# EAGLE design led-er-v2.3c (EAGLE 7.5.0)
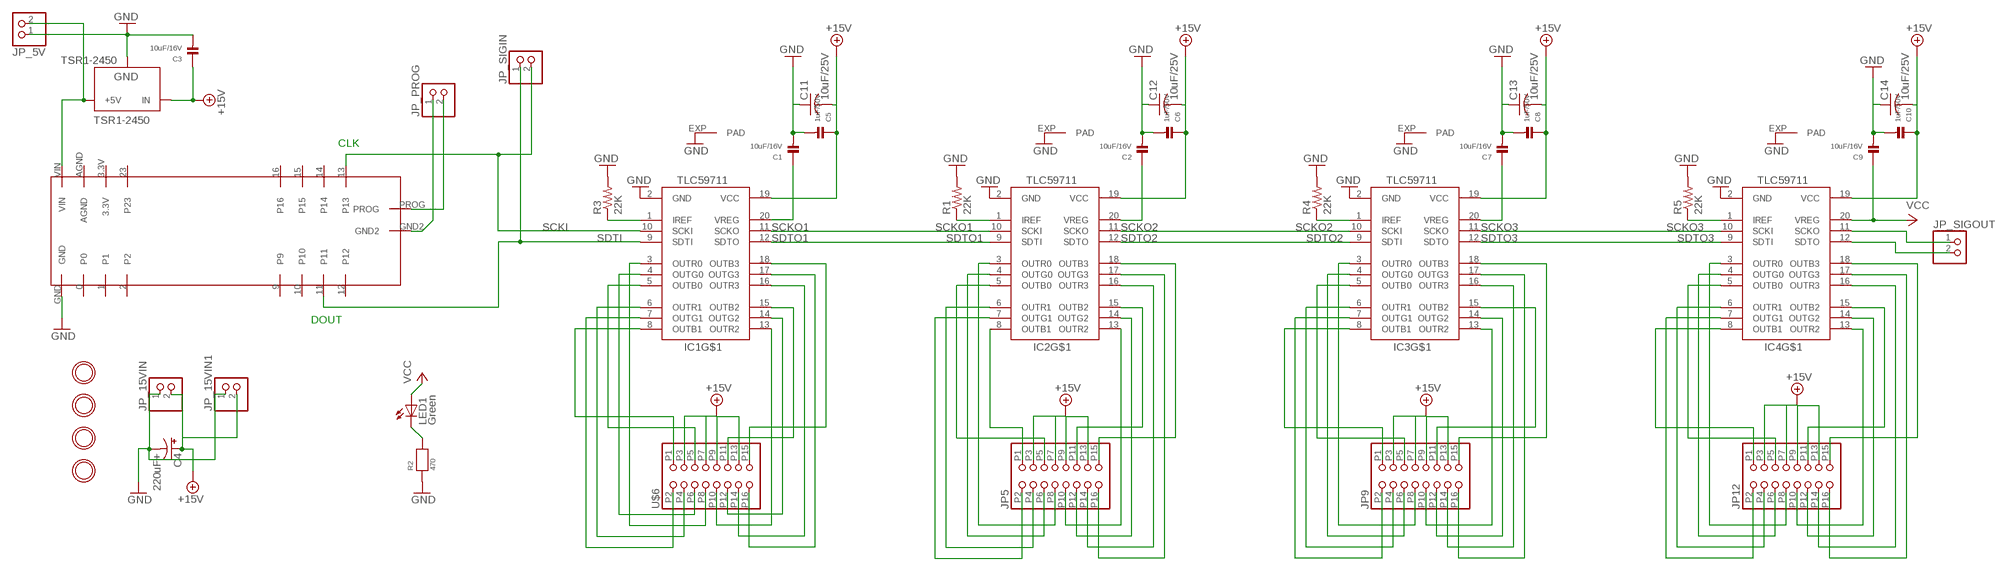
[diagram p0: schematic, sheet 1]

## Parts
C1  10uF/16V  CAP_CERAMIC0805  [0805]
C2  10uF/16V  CAP_CERAMIC0805  [0805]
C3  10uF/16V  CAP_CERAMIC0805  [0805]
C4  220uF+  CPOL-USE5-8.5  [E5-8,5]
C5  1uF/50V  CAP_CERAMIC0805  [0805]
C6  1uF/50V  CAP_CERAMIC0805  [0805]
C7  10uF/16V  CAP_CERAMIC0805  [0805]
C8  1uF/50V  CAP_CERAMIC0805  [0805]
C9  10uF/16V  CAP_CERAMIC0805  [0805]
C10  1uF/50V  CAP_CERAMIC0805  [0805]
C11  10uF/25V  C-USC0805  [C0805]
C12  10uF/25V  C-USC0805  [C0805]
C13  10uF/25V  C-USC0805  [C0805]
C14  10uF/25V  C-USC0805  [C0805]
IC1  TLC59711  [HTSSOP20DAP]
IC2  TLC59711  [HTSSOP20DAP]
IC3  TLC59711  [HTSSOP20DAP]
IC4  TLC59711  [HTSSOP20DAP]
JP5  HEADER-2X8-RIBBON  [2X08_RIBBON]
JP9  HEADER-2X8-RIBBON  [2X08_RIBBON]
JP12  HEADER-2X8-RIBBON  [2X08_RIBBON]
JP_5V  HEADER-1X2  [1X02_OVAL]
JP_15VIN  HEADER-1X2  [1X02_OVAL]
JP_15VIN1  HEADER-1X2  [1X02_OVAL]
JP_PROG  HEADER-1X2  [1X02_OVAL]
JP_SIGIN  HEADER-1X2  [1X02_OVAL]
JP_SIGOUT  HEADER-1X2  [1X02_OVAL]
LED1  Green  LEDCHIP-LED0805  [CHIP-LED0805]
R1  22K  R-US_FLIPFLOP7  [0805-THM-7]
R2  470  RESISTOR0805  [0805]
R3  22K  R-US_FLIPFLOP7  [0805-THM-7]
R4  22K  R-US_FLIPFLOP7  [0805-THM-7]
R5  22K  R-US_FLIPFLOP7  [0805-THM-7]
TSR1-2450  TSR1-2450  [TSR-1]
U$1  MOUNTINGHOLE  [MOUNTINGHOLE_3.0_PLATED]
U$2  MOUNTINGHOLE  [MOUNTINGHOLE_3.0_PLATED]
U$3  MOUNTINGHOLE  [MOUNTINGHOLE_3.0_PLATED]
U$4  MOUNTINGHOLE  [MOUNTINGHOLE_3.0_PLATED]
U$5  TEENSY_LEDER  [TEENSY_LEDER]
U$6  HEADER-2X8-RIBBON  [2X08_RIBBON]

## Nets
+15V: C3.1 C4.+ C5.1 C6.1 C8.1 C10.1 C11.2 C12.2 C13.2 C14.2 IC1.19(VCC) IC2.19(VCC) IC3.19(VCC) IC4.19(VCC) JP5.P3 JP5.P7 JP5.P9 JP5.P13 JP9.P3 JP9.P7 JP9.P9 JP9.P13 JP12.P3 JP12.P7 JP12.P9 JP12.P13 JP_15VIN1.2 JP_15VIN.2 TSR1-2450.1(IN) U$6.P3 U$6.P7 U$6.P9 U$6.P13
GND: C1.2 C2.2 C3.2 C4.- C5.2 C6.2 C7.2 C8.2 C9.2 C10.2 C11.1 C12.1 C13.1 C14.1 IC1.2(GND) IC1.EXP(PAD) IC2.2(GND) IC2.EXP(PAD) IC3.2(GND) IC3.EXP(PAD) IC4.2(GND) IC4.EXP(PAD) JP_5V.1 JP_15VIN1.1 JP_15VIN.1 R1.2 R2.1 R3.2 R4.2 R5.2 TSR1-2450.2(GND) U$5.GND
JP1: JP_5V.2 TSR1-2450.3(+5V) U$5.VIN
N$1: LED1.C R2.2
N$2: IC1.1(IREF) R3.1
N$3: IC1.4(OUTG0) U$6.P6
N$4: IC1.3(OUTR0) U$6.P8
N$5: IC1.14(OUTG2) U$6.P12
N$6: IC1.13(OUTR2) U$6.P10
N$7: IC2.7(OUTG1) JP5.P2
N$8: IC2.6(OUTR1) JP5.P4
N$9: IC2.5(OUTB0) JP5.P5
N$10: IC2.4(OUTG0) JP5.P6
N$11: IC1.15(OUTB2) U$6.P11
N$12: IC1.16(OUTR3) U$6.P14
N$13: IC1.17(OUTG3) U$6.P16
N$14: IC1.18(OUTB3) U$6.P15
N$15: IC2.1(IREF) R1.1
N$16: IC3.8(OUTB1) JP9.P1
N$17: IC2.13(OUTR2) JP5.P10
N$18: IC3.4(OUTG0) JP9.P6
N$19: IC4.7(OUTG1) JP12.P2
N$20: IC3.7(OUTG1) JP9.P2
N$21: IC4.6(OUTR1) JP12.P4
N$22: IC3.6(OUTR1) JP9.P4
N$23: IC2.14(OUTG2) JP5.P12
N$24: IC2.15(OUTB2) JP5.P11
N$25: IC2.16(OUTR3) JP5.P14
N$26: IC2.17(OUTG3) JP5.P16
N$27: IC2.18(OUTB3) JP5.P15
N$28: IC3.1(IREF) R4.1
N$29: IC3.14(OUTG2) JP9.P12
N$30: IC2.8(OUTB1) JP5.P1
N$31: IC3.13(OUTR2) JP9.P10
N$37: IC3.15(OUTB2) JP9.P11
N$38: IC3.16(OUTR3) JP9.P14
N$39: IC3.17(OUTG3) JP9.P16
N$40: IC3.18(OUTB3) JP9.P15
N$41: IC4.1(IREF) R5.1
N$42: IC2.3(OUTR0) JP5.P8
N$43: IC4.13(OUTR2) JP12.P10
N$44: IC3.5(OUTB0) JP9.P5
N$45: IC1.6(OUTR1) U$6.P4
N$46: IC1.5(OUTB0) U$6.P5
N$47: IC1.7(OUTG1) U$6.P2
N$48: IC1.8(OUTB1) U$6.P1
N$49: IC4.14(OUTG2) JP12.P12
N$50: IC4.15(OUTB2) JP12.P11
N$51: IC4.16(OUTR3) JP12.P14
N$52: IC4.17(OUTG3) JP12.P16
N$53: IC4.18(OUTB3) JP12.P15
N$54: JP_PROG.1 U$5.GND2
N$55: JP_PROG.2 U$5.PROG
N$56: C1.1 IC1.20(VREG)
N$57: C7.1 IC3.20(VREG)
N$58: C2.1 IC2.20(VREG)
N$59: IC4.11(SCKO) JP_SIGOUT.1
N$60: IC4.12(SDTO) JP_SIGOUT.2
N$61: IC3.3(OUTR0) JP9.P8
N$62: IC4.3(OUTR0) JP12.P8
N$71: IC4.4(OUTG0) JP12.P6
N$79: IC4.5(OUTB0) JP12.P5
N$80: IC4.8(OUTB1) JP12.P1
SCKI: IC1.10(SCKI) JP_SIGIN.2 U$5.13
SCKO1: IC1.11(SCKO) IC2.10(SCKI)
SCKO2: IC2.11(SCKO) IC3.10(SCKI)
SCKO3: IC3.11(SCKO) IC4.10(SCKI)
SDTI: IC1.9(SDTI) JP_SIGIN.1 U$5.11
SDTO1: IC1.12(SDTO) IC2.9(SDTI)
SDTO2: IC2.12(SDTO) IC3.9(SDTI)
SDTO3: IC3.12(SDTO) IC4.9(SDTI)
VCC: C9.1 IC4.20(VREG) LED1.A
Unconnected: U$5.0 U$5.1 U$5.2 U$5.3.3V U$5.9 U$5.10 U$5.12 U$5.14 U$5.15 U$5.16 U$5.23 U$5.AGND

## Notes on the sheet
- CLK
- DOUT

## Library data of the parts
C1-C3 C5-C10 = microbuilder:CAP_CERAMIC: Ceramic Capacitors 0402 - 0402 Surface Mount Capacitors 16pF 50V 5% [Digikey: 445-4899-2-ND] 18pF 50V 5% [Digikey: 490-1281-2-ND] 22pF 50V 5% [Digikey: 490-1283-2-ND] 68pF 50V 5% [Digikey: 490-1289-2-ND] 0.1uF 10V 10% [Digikey: 490-1318-2-ND] 1.0uF 6.3V 10% [Digikey: 490-1320-2-ND] 0603 - 0603 Surface Mount Capacitors 16 pF 50V 5% [Digikey: 445-5051-2-ND] 22 pF 50V [Digikey: PCC220ACVTR-ND] 33 pF 50V 5% [Digikey: 490-1415-1-ND] 56pF 50V 5% [Digikey: 490-1421-1-ND] 220pF 50V 5% [Digikey: 445-1285-1-ND] 680 pF 50V 2200 pF 50V 5% C0G [Digikey: 445-1297-1-ND] 5600 pF 100V 5% X7R [Digikey: 478-3711-1-ND] 0.1 µF 25V 10% [Digikey: PCC2277TR-ND] 0.22 µF 16V 10% X7R [Digikey: 445-1318-1-ND] 1.0 µF 25V 10% [Digikey: 445-5146-2-ND] 0603 - RF Specific 3pF 250V +/-0.1pF RF [Digikey: 712-1347-1-ND] 18 pF 250V 5% [Digikey: 478-3505-1-ND or 712-1322-1-ND] 56 pF 250V 5% C0G RF [Digikey: 490-4867-1-ND] 68 pF 250V RF [Digikey: 490-4868-1-ND] 0805 - 0805 Surface Mount Capacitors 220 pF 250V 2% RF Ceramic Capacitor [Digikey: 712-1398-1-ND] 1000 pF 50V 2% NP0 Ceramic Capacitor [Digikey: 478-3760-1-ND] 0.1 µF 25V 10% Ceramic Capacitor [Digikey: PCC1828TR-ND] 1.0 µF 16V 10% Ceramic Capacitor[Digikey: 490-1691-2-ND] 10.0 µF 10V 10% Ceramic Capacitor[Digikey: 709-1228-1-ND] 10.0 uF 16V 10% Ceramic Capacitor [Digikey: 478-5165-2-ND] 47 uF 6.3V 20% Ceramic Capacitor [Digikey: 587-1779-1-ND or 399-5506-1-ND] 1206 - 1206 Surface Mount Capacitors 47uF 10V 20% Ceramic Capacitor [Digikey: 490-5528-1-ND or 399-5508-1-ND or 445-6010-1-ND] 100uF 6.3V -20%, +80% Y5V Ceramic Capacitor (Digikey: 490-4512-1-ND, Mouser: 81-GRM31CF50J107ZE1L)
C4 = adafruit:CPOL-US: POLARIZED CAPACITOR, American symbol
C11-C14 = adafruit:C-US: CAPACITOR, American symbol
IC1-IC4 = adafruit:TLC59711
JP5 JP9 JP12 U$6 = Andrews:HEADER-2X8-RIBBON
JP_5V JP_15VIN JP_15VIN1 JP_PROG JP_SIGIN JP_SIGOUT = microbuilder:HEADER-1X2: PIN HEADER
LED1 = adafruit:LED: LED OSRAM: - CHIPLED LG R971, LG N971, LY N971, LG Q971, LY Q971, LO R971, LY R971 LH N974, LH R974 LS Q976, LO Q976, LY Q976 LO Q996 - Hyper CHIPLED LW Q18S LB Q993, LB Q99A, LB R99A - SideLED LS A670, LO A670, LY A670, LG A670, LP A670 LB A673, LV A673, LT A673, LW A673 LH A674 LY A675 LS A676, LA A676, LO A676, LY A676, LW A676 LS A679, LY A679, LG A679 - Hyper Micro SIDELED® LS Y876, LA Y876, LO Y876, LY Y876 LT Y87S - SmartLED LW L88C, LW L88S LB L89C, LB L89S, LG L890 LS L89K, LO L89K, LY L89K LS L896, LA L896, LO L896, LY L896 - TOPLED LS T670, LO T670, LY T670, LG T670, LP T670 LSG T670, LSP T670, LSY T670, LOP T670, LYG T670 LG T671, LOG T671, LSG T671 LB T673, LV T673, LT T673, LW T673 LH T674 LS T676, LA T676, LO T676, LY T676, LB T676, LH T676, LSB T676, LW T676 LB T67C, LV T67C, LT T67C, LS T67K, LO T67K, LY T67K, LW E67C LS E67B, LA E67B, LO E67B, LY E67B, LB E67C, LV E67C, LT E67C LW T67C LS T679, LY T679, LG T679 LS T770, LO T770, LY T770, LG T770, LP T770 LB T773, LV T773, LT T773, LW T773 LH T774 LS E675, LA E675, LY E675, LS T675 LS T776, LA T776, LO T776, LY T776, LB T776 LHGB T686 LT T68C, LB T68C - Hyper Mini TOPLED® LB M676 - Mini TOPLED Santana® LG M470 LS M47K, LO M47K, LY M47K Source: http://www.osram.convergy.de/
R1 R3-R5 = adafruit:R-US_: RESISTOR, American symbol
R2 = microbuilder:RESISTOR: Resistors 0402 - 0402 Surface Mount Package 22 Ohm 1% 1/16W [Digikey: 311-22.0LRTR-ND] 33 Ohm 5% 1/16W 1.0K 5% 1/16W 1.5K 5% 1/16W 2.0K 1% 1/16W 10.0K 1% 1/16W [Digikey: 311-10.0KLRTR-ND] 10.0K 5% 1/16W [Digikey: RMCF0402JT10K0TR-ND] 12.1K 1% 1/16W [Digikey: 311-22.0LRTR-ND] 100.0K 5% 1/16W 0603 - 0603 Surface Mount Package 0 Ohm 1/10 Watt 1% Resistor 15 Ohm 1/10 Watt 1% Resistor 33 Ohm 1/10 Watt 1% Resistor 49.9 Ohm 1/10 Watt 1% Resistor 100 Ohm 1/10 Watt 1% Resistor 150 Ohm 1/10 Watt 1% Resistor 240 Ohm 1/10 Watt 1% Resistor 390 Ohm 1/10 Watt 1% Resistor 560 Ohm 1/10 Watt 1% Resistor 680 Ohm 1/10 Watt 1% Resistor 750 Ohm 1/10 Watt 1% Resistor 1.0K Ohm 1/10 Watt 1% Resistor 1.5K Ohm 1/10 Watt 1% Resistor 2.0K Ohm 1/10 Watt 1% Resistor 2.2K Ohm 1/10 Watt 1% Resistor 3.3K Ohm 1/10 Watt 1% Resistor 4.7K Ohm 1/10 Watt 1% Resistor 10.0K Ohm 1/10 Watt 1% Resistor 12.0K Ohm 1/10 Watt 1% Resistor 12.1K Ohm 1/10 Watt 1% Resistor 20.0K Ohm 1/10 Watt 1% Resistor 33.0K Ohm 1/10 Watt 1% Resistor 100.0K Ohm 1/10 Watt 1% Resistor 0805 - 0805 Surface Mount Package 0 Ohm 1/8 Watt 1% Resistor 33 Ohm 1/8 Watt 1% Resistor 100 Ohm 1/8 Watt 1% Resistor 150 Ohm 1/8 Watt 1% Resistor 200 Ohm 1/8 Watt 1% Resistor 240 Ohm 1/8 Watt 1% Resistor 330 Ohm 1/8 Watt 1% Resistor 390 Ohm 1/8 Watt 1% Resistor 470 Ohm 1/8 Watt 1% Resistor 1.0K Ohm 1/8 Watt 1% Resistor 1.5K Ohm 1/8 Watt 1% Resistor 2.0K Ohm 1/8 Watt 1% Resistor 4.7K Ohm 1/8 Watt 1% Resistor 5.1K Ohm 1/8 Watt 1% Resistor 5.6K Ohm 1/8 Watt 1% Resistor 10.0K Ohm 1/8 Watt 1% Resistor 22.0K Ohm 1/8 Watt 1% Resistor 33.0K Ohm 1/8 Watt 1% Resistor 100K Ohm 1/8 Watt 1% Resistor 1206 - 1206 Surface Mount Package 2012 - 2010 Surface Mount Package 0.11 Ohm 1/2 Watt 1% Resistor - Digikey: RHM.11UCT-ND
TSR1-2450 = SteelCaveRobotics-Power:TSR1-2450: Traco Power TSR 1-2450 5.0v switching regulator
U$1-U$4 = microbuilder:MOUNTINGHOLE: Mounting Hole For #2 screws (0.086"/2.18mm width, 0.094"/2.4mm hole) use 2.5mm
U$5 = Andrews:TEENSY_LEDER

## Board
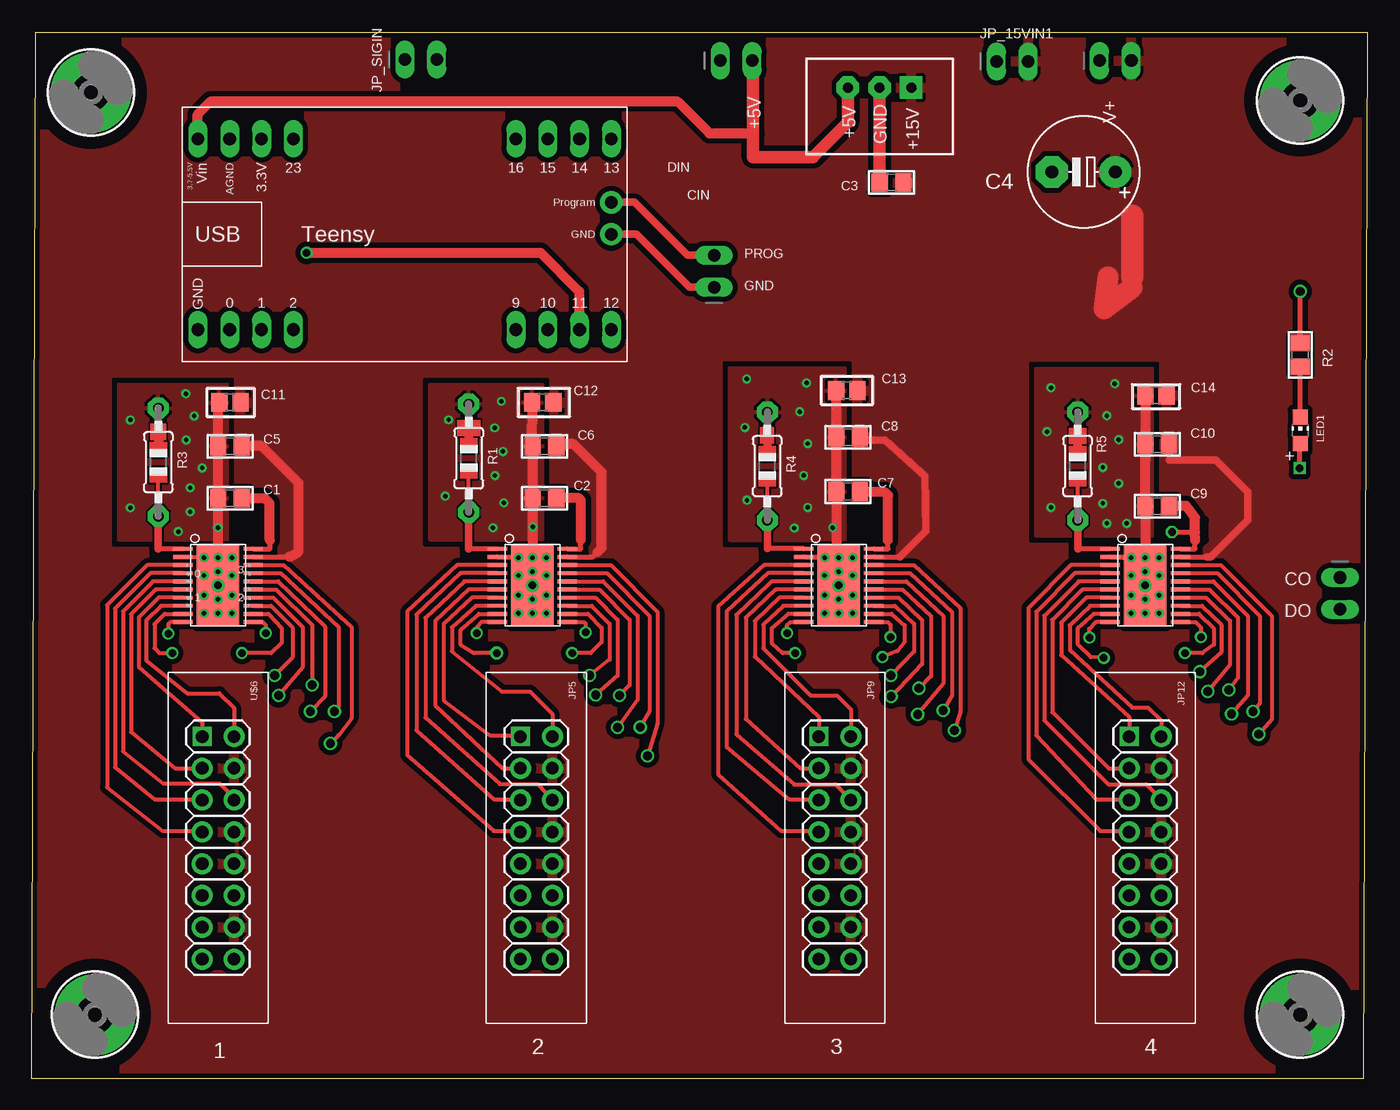
[diagram p1: board, top side]
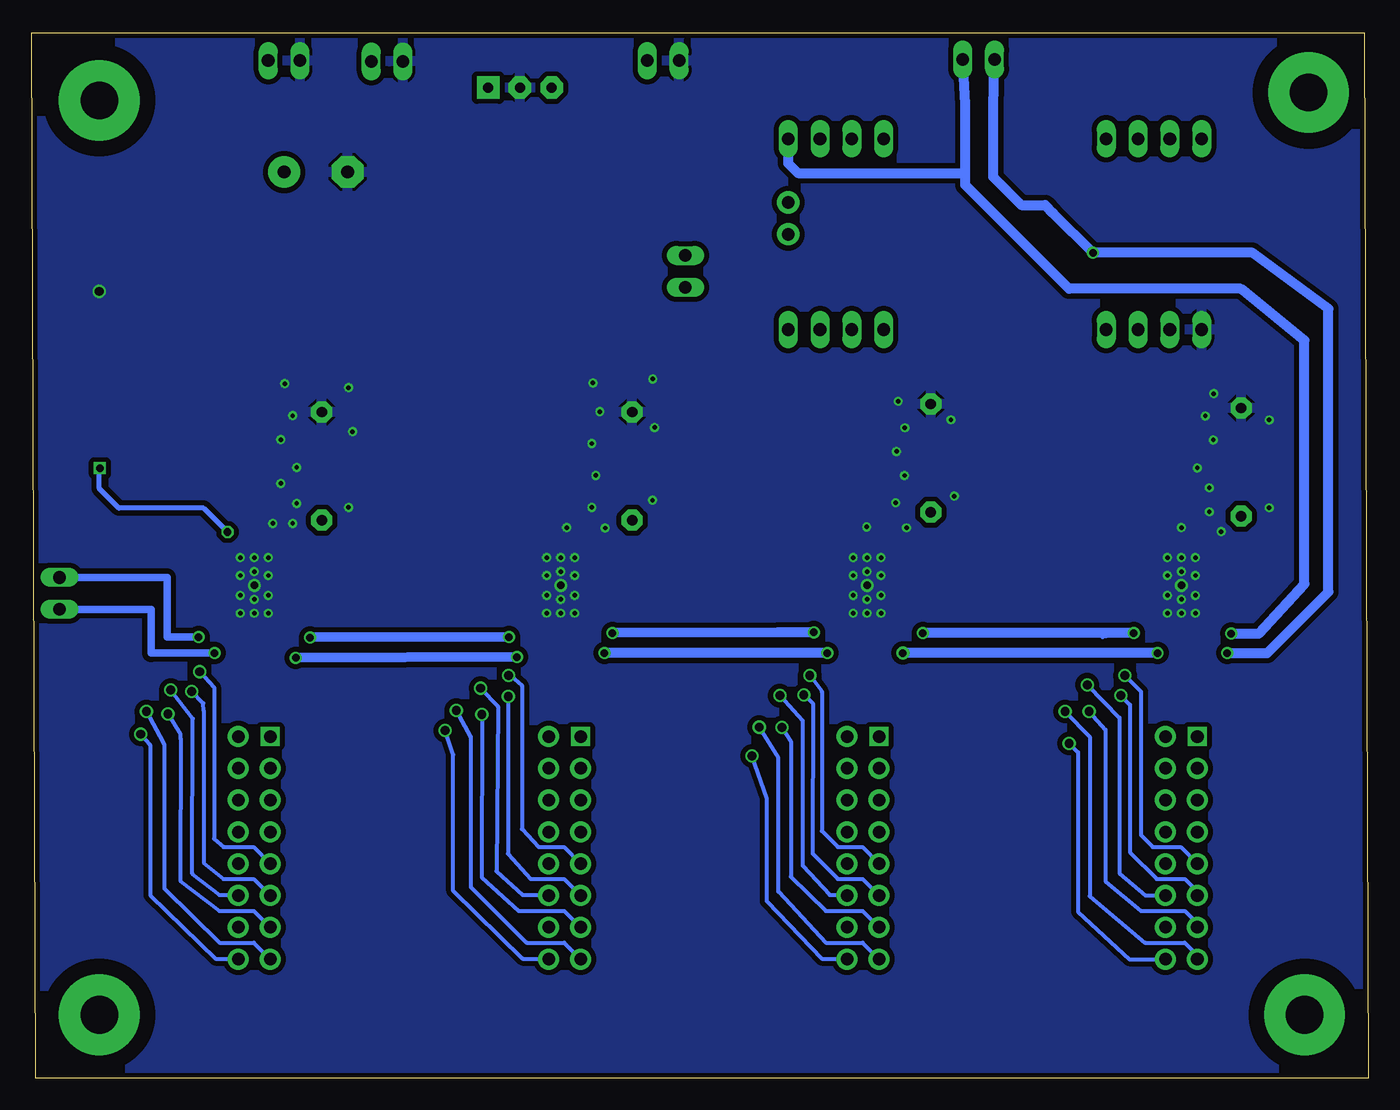
[diagram p2: board, bottom side, seen from below]

Size 106.72 x 83.49 mm. Coordinates in mm from the lower left corner, seen from the top.
Outline: 0,0 106.41,0 106.72,83.49 0.32,83.49 0,0
Copper layers (1*16): Top 0.0356mm / dielectric 1.5011mm / Bottom 0.0356mm
Design rules "LaenPCBOrder": minimum track width 6mil, minimum drill 13mil, track to track 6mil, track to pad 6mil, pad to pad 6mil, via to via 6mil, smd to smd 6mil, copper to edge 15mil, drill to drill 6mil, minimum pad ring 7mil, minimum via ring 7mil, stop-mask expansion 3mil, vias tented up to drill 0mil, thermal gap 10mil
tRestrict: area 90.1,43 to 93.6,44.6; area 14,18.1 to 15.9,18.7; area 15.6,15.6 to 16.6,15.9; area 15.6,20.7 to 16.6,21; area 39.5,18.3 to 41.7,18.6; area 63.4,18.2 to 65.3,18.5; area 64.3,15.6 to 65.6,15.9; area 88.9,18.2 to 90.1,18.5

### Footprints (pad centres in the part's own frame; a part is rotated, then mirrored left to right if it is on the bottom)
0805 = smd 1.3 x 1.5: 1 -0.95,0; 2 0.95,0
E5-8,5 = drill 1.016 pad 2.54: + -2.54,0 | drill 1.016 pad 2.54 octagon: - 2.54,0
C0805 = smd 1.3 x 1.5: 1 -0.85,0; 2 0.85,0
HTSSOP20DAP = smd 0.3 x 1.55: 1 -2.925,-2.8; 2 -2.275,-2.8; 3 -1.625,-2.8; 4 -0.975,-2.8; 5 -0.325,-2.8; 6 0.325,-2.8; 7 0.975,-2.8; 8 1.625,-2.8; 9 2.275,-2.8; 10 2.925,-2.8; 11 2.925,2.8; 12 2.275,2.8; 13 1.625,2.8; 14 0.975,2.8; 15 0.325,2.8; 16 -0.325,2.8; 17 -0.975,2.8; 18 -1.625,2.8; 19 -2.275,2.8; 20 -2.925,2.8 | smd 6.5 x 3.4: EXP 0,0
2X08_RIBBON = drill 1 pad 1.676: P1 -8.89,1.27; P3 -6.35,1.27; P4 -6.35,-1.27; P5 -3.81,1.27; P6 -3.81,-1.27; P7 -1.27,1.27; P8 -1.27,-1.27; P9 1.27,1.27; P10 1.27,-1.27; P11 3.81,1.27; P12 3.81,-1.27; P13 6.35,1.27; P14 6.35,-1.27; P15 8.89,1.27; P16 8.89,-1.27 | drill 1 square: P2 -8.89,-1.27
1X02_OVAL = drill 1 long: 1 -1.27,0; 2 1.27,0
CHIP-LED0805 = smd 1.2 x 1.2: A 0,-1.05; C 0,1.05
0805-THM-7 = drill 0.813 pad 1.676 octagon: 1 -4.318,0; 2 4.318,0
TSR-1 = drill 0.8 pad 1.8 square: 1 -2.54,-1.5 | drill 0.8 pad 1.8 octagon: 2 0,-1.5; 3 2.54,-1.5
MOUNTINGHOLE_3.0_PLATED = drill 3 pad 6.452: P$1 0,0
TEENSY_LEDER = drill 1 pad 1.422 long: 0 12.7,7.62; 1 10.16,7.62; 2 7.62,7.62; 3.3V 10.16,-7.62; 9 -10.16,7.62; 10 -12.7,7.62; 11 -15.24,7.62; 12 -17.78,7.62; 13 -17.78,-7.62; 14 -15.24,-7.62; 15 -12.7,-7.62; 16 -10.16,-7.62; 23 7.62,-7.62; AGND 12.7,-7.62; GND 15.24,7.62; VIN 15.24,-7.62 | drill 1 pad 1.778: GND2 -17.78,0; PROG -17.78,-2.54

### Placement (x,y rotation side)
C1  15.87,46.33 180 top
C2  40.97,46.33 180 top
C3  68.69,71.55 180 top
C4  84.04,72.4 180 top
C5  15.87,50.5 180 top
C6  40.97,50.5 180 top
C7  65.23,46.87 180 top
C8  65.22,51.22 180 top
C9  89.91,45.7 180 top
C10  89.91,50.65 180 top
C11  15.87,53.99 0 top
C12  40.84,53.99 0 top
C13  65.12,54.94 0 top
C14  89.82,54.55 0 top
IC1  14.92,39.37 270 top
IC2  40.02,39.37 270 top
IC3  64.49,39.37 270 top
IC4  88.96,39.37 270 top
JP5  40.34,18.41 270 top
JP9  64.17,18.41 270 top
JP12  88.96,18.41 270 top
JP_5V  56.29,81.28 0 top
JP_15VIN  86.58,81.28 0 top
JP_15VIN1  78.35,81.22 0 top
JP_PROG  54.53,64.45 90 top
JP_SIGIN  31.11,81.38 0 top
JP_SIGOUT  104.52,38.73 270 top
LED1  101.34,51.75 0 top
R1  34.94,49.53 90 top
R2  101.34,57.78 270 top
R3  10.15,49.21 90 top
R4  58.77,48.89 90 top
R5  83.56,48.89 90 top
TSR1-2450  67.74,77.63 180 top
U$1  101.34,78.11 0 top
U$2  5.08,5.08 0 top
U$3  101.34,5.08 0 top
U$4  4.76,78.74 0 top
U$5  28.54,67.42 180 top
U$6  14.92,18.41 270 top

### Tracks (layer width: path | path; a pad name or v marks a point on that pad's centre or on a via)
+15V
  Top 0.406: IC1.19 20.62,41.65 | C5.1 | IC2.19 44.83,41.65 45.23,42.04 | 42.07,50.64 C6.1 | IC3.19 69.36,41.65 | 66.23,50.96 C8.1 | IC4.19 93.88,41.65 | 90.87,49.37 C10.1
  Top 0.61: 66.23,50.96 68.16,50.96 71.35,48.1 71.43,43.71 69.91,42.19 69.36,41.65 | 90.87,49.37 94.6,49.37 97.15,46.82 97.15,44.59 94.2,41.65 93.88,41.65
  Top 0.813: C5.1 18.41,50.49 21.34,47.56 21.34,42.04 20.62,41.65 | 42.07,50.64 43.32,50.64 45.55,48.41 45.55,42.36 45.23,42.04
  Top 1.676: 87.91,63.16 85.68,61.47 86,64.02
  Top 1.778: 87.91,68.89 87.91,64.02
  pour Top (isolate 0.406, rank 2): 0.32,83.19 0,0 106.42,0.32 106.74,83.5
GND  (via drill 0.36, 0.6 pad 1.02, 0.7)
  Top 0.305: 38.7,41.65 v38.91,41.59 | IC1.2 13.96,41.65 v13.8,41.59
  Top 0.406: IC2.2 38.7,41.65 | R2.1 v101.34,62.87 | IC3.2 63.54,41.65 v63.38,41.59 | IC4.2 88.01,41.65 v87.85,41.59 | 40.02,41.44 v40.02,41.59
  Top 0.61: 14.91,46.01 C1.2 | 14.92,53.89 C11.1 | 39.97,50.6 C6.2
  Top 0.813: v14.91,41.59 14.91,46.01 | C1.2 C5.2 14.92,53.89 | C12.1 39.97,50.6 | C6.2 C2.2 40.02,41.44 | C13.1 64.27,50.9 C8.2 64.27,46.88 C7.2 64.28,41.64 v64.49,41.59 | 88.96,46.35 v88.96,41.59 | C9.2 C10.2 88.97,49.39 C14.1
  Top 1.016: TSR1-2450.2 C3.2
  other vias: 88.96,39.37 90.07,37.15 88.96,37.15 87.85,37.15 90.07,38.58 88.96,38.26 87.85,38.58 90.07,40.16 88.96,40.48 87.85,40.16 64.49,39.37 65.6,38.58 64.49,38.26 63.38,38.58 65.6,37.15 64.49,37.15 63.38,37.15 65.6,40.16 64.49,40.48 63.38,40.16 40.02,39.37 38.91,38.58 40.02,38.26 41.13,38.58 41.13,40.16 40.02,40.48 38.91,40.16 38.91,37.15 40.02,37.15 41.13,37.15 14.92,39.37 16.03,40.16 14.92,40.48 13.8,40.16 16.03,41.59 16.03,38.58 14.92,38.26 13.8,38.58 13.8,37.15 14.92,37.15 16.03,37.15 41.13,41.59 65.6,41.59 90.07,41.59 12.37,50.99 12.69,45.26 13.64,48.76 12.34,54.68 13.01,52.9 12.69,47.17 37.53,54.07 37.01,51.96 36.86,43.98 40.05,44.05 33.33,52.6 33.06,46.5 60.93,43.96 62,45.6 64.01,43.99 61.91,55.55 57.16,46.18 56.98,51.99 14.92,43.98 11.73,43.66 7.91,45.57 7.91,52.58 37.67,50.07 37.03,48.15 37.74,45.97 61.69,48.15 62,50.7 61.37,53.25 57.14,55.86 81.43,45.6 81.12,51.66 81.43,55.16 86.53,55.48 85.89,52.93 86.85,51.02 85.57,48.79 86.85,47.52 85.57,45.92 87.49,44.33 85.89,44.33
  pour Bottom (isolate 0.406, rank 2): 0,83.19 0,0 106.42,0.32 106.42,83.5
  pour Top: 7.01,55.42 15.61,55.42 15.61,43 7.01,43
  pour Top: 31.85,43 31.85,55.42 40.77,55.42 40.77,43
  pour Top: 55.74,43 64.98,43 64.98,56.7 55.74,56.7
  pour Top: 80.27,56.7 89.5,56.7 89.5,43.32 80.27,43.32
JP1
  Top 0.813: U$5.VIN 13.3,77 14.33,78.04 51.6,78.04 54.15,75.49 57.65,75.49
  Top 1.016: JP_5V.2 57.65,80.87 57.65,75.49 57.65,73.58 62.43,73.58 65.2,76.35 TSR1-2450.3
N$1
  Top 0.406: LED1.C R2.2
N$2
  Top 0.406: IC1.1 10.15,42.3
  Top 0.61: 10.15,42.3 R3.1
N$3
  Top 0.305: IC1.4 9.52,40.35 6.69,37.52 6.69,24.84 9.87,22.3 13.57,22.3 U$6.P6
N$4
  Top 0.305: IC1.3 9.25,41 6.05,37.8 6.05,23.25 10.51,19.75 13.58,19.75 U$6.P8
N$5  (via drill 0.7)
  Top 0.305: IC1.14 19.32,38.4 21.66,36.06 21.66,32.81 v19.75,30.58
  Bottom 0.305: U$6.P12 13.64,14.92 14.65,15.93 16.88,15.93 19.03,18.05 19.03,29.84 v19.75,30.58
N$6  (via drill 0.7)
  Top 0.305: IC1.13 19.15,37.75 19.75,37.15 20.87,36.03 20.87,33.6 v19.43,32.17
  Bottom 0.305: v19.43,32.17 18.16,30.9 18.16,19.43 17.2,18.47 14.97,18.47 U$6.P10
N$7
  Top 0.305: IC2.7 35.19,38.39 32.93,36.27 32.93,30.2 36.63,27.39 38.98,27.39 JP5.P2
N$8
  Top 0.305: IC2.6 34.9,39.05 32.25,36.52 32.25,29.79 37.63,24.76 JP5.P4
N$9
  Top 0.305: IC2.5 34.6,39.7 31.48,36.78 31.48,28.81 37.43,23.51 40.42,23.51 JP5.P5
N$10
  Top 0.305: IC2.4 34.29,40.34 30.76,37.03 30.76,27.8 36.95,22.3 39,22.3 JP5.P6
N$11  (via drill 0.7)
  Top 0.305: IC1.15 19.56,39.05 22.43,36.21 v22.43,31.43
  Bottom 0.305: U$6.P11 17.79,14.61 19.86,16.38 19.86,28.8 v22.43,31.43
N$12  (via drill 0.7)
  Top 0.305: IC1.16 19.71,39.69 23.46,36.09 23.46,30.52 v22.3,29.3
  Bottom 0.305: U$6.P14 13.64,12.37 14.65,13.38 18.16,13.38 20.98,15.74 20.98,27.85 v22.3,29.3
N$13  (via drill 0.7)
  Top 0.305: IC1.17 19.91,40.35 24.53,36.05 24.53,29.62 v24.21,29.3
  Bottom 0.305: U$6.P16 13.64,9.82 14.65,10.83 17.84,10.83 22.23,14.55 22.23,27.29 v24.21,29.3
N$14  (via drill 0.7)
  Top 0.305: IC1.18 20.15,40.99 25.58,36.07 25.58,28.76 24.53,27.39 | 24.53,27.39 | 24.53,27.39 v23.89,26.75
  Bottom 0.305: U$6.P15 19.08,9.53 23.17,13.3 23.17,26.05 v23.89,26.75
N$15
  Top 0.406: IC2.1 34.94,42.3
  Top 0.61: 34.94,42.3 R1.1
N$16
  Top 0.305: IC3.8 60.05,37.74 58.47,36.25 58.47,34.35 62.23,30.59 64.34,30.58 65.44,29.48 JP9.P1
N$17  (via drill 0.7)
  Top 0.305: IC2.13 44.75,37.74 46.19,36.31 46.19,33.44 v44.59,32.17
  Bottom 0.305: v44.59,32.17 43.64,30.9 43.64,19.75 42.36,18.47 40.4,18.47 JP5.P10
N$18
  Top 0.305: IC3.4 58.82,40.34 55.52,37.31 55.52,26.48 60.52,22.3 62.83,22.3 JP9.P6
N$19
  Top 0.305: IC4.7 84.26,38.4 82.25,36.41 82.25,33.81 87.67,28.85 87.67,27.32 JP12.P2
N$20
  Top 0.305: IC3.7 59.74,38.4 57.79,36.52 57.79,33.69 62.9,28.88 JP9.P2
N$21
  Top 0.305: IC4.6 83.96,39.05 81.54,36.63 81.54,29.26 86.06,24.74 87.67,24.74 JP12.P4
N$22
  Top 0.305: IC3.6 59.43,39.05 57.05,36.8 57.05,28.71 61.42,24.77 JP9.P4
N$23  (via drill 0.7)
  Top 0.305: IC2.14 45.06,38.4 46.82,36.63 46.82,32.17 v45.07,30.62
  Bottom 0.305: v45.07,30.62 44.35,29.96 44.37,17.95 42.36,15.93 40.39,15.93 JP5.P12
N$24  (via drill 0.7)
  Top 0.305: IC2.15 45.36,39.05 47.78,36.63 47.78,31.42 v46.98,30.58
  Bottom 0.305: v46.98,30.58 45.16,28.59 45.16,17.01 43,14.65 41.65,14.65 JP5.P11
N$25  (via drill 0.7)
  Top 0.305: IC2.16 45.67,39.7 48.41,36.95 48.41,30.26 v46.82,28.03
  Bottom 0.305: v46.82,28.03 46.1,26.93 46.1,16.1 43.32,13.38 40.38,13.38 JP5.P14
N$26  (via drill 0.7)
  Top 0.305: IC2.17 45.97,40.34 49.37,36.95 49.37,29.3 v48.63,28.05
  Bottom 0.305: JP5.P16 40.37,10.83 43.32,10.83 47.11,14.94 47.11,25.58 v48.63,28.05
N$27  (via drill 0.7)
  Top 0.305: IC2.18 46.28,40.99 50.01,37.27 50.01,28.35 v49.21,25.76
  Bottom 0.305: JP5.P15 41.64,9.55 43.64,9.55 48.03,14.14 48.03,22.35 v49.21,25.76
N$28
  Top 0.305: IC3.1 61.67,42.31
  Top 0.406: 61.67,42.31 58.77,42.31
  Top 0.61: 58.77,42.31 R4.1
N$29  (via drill 0.7)
  Top 0.305: IC3.14 69.26,38.4 71.14,36.6 71.14,33.09 v68.68,30.5
  Bottom 0.305: v68.68,30.5 68.7,17.94 66.89,15.93 64.22,15.93 JP9.P12
N$30
  Top 0.305: IC2.8 35.51,37.74 33.6,36.02 33.6,34.1 37.59,30.9 39.81,30.9 41.61,29.1 JP5.P1
N$31  (via drill 0.7)
  Top 0.305: IC3.13 68.96,37.74 70.51,36.31 70.51,34.08 v68.64,32.17
  Bottom 0.305: v68.64,32.17 68.48,32.17 67.59,31.38 67.59,19.91 66.25,18.47 64.23,18.47 JP9.P10
N$37  (via drill 0.7)
  Top 0.305: IC3.15 69.57,39.05 71.86,36.91 71.86,32.14 v70.89,31.15
  Bottom 0.305: v70.89,31.15 69.49,29.7 69.62,16.54 67.53,14.65 65.49,14.65 JP9.P11
N$38  (via drill 0.7)
  Top 0.305: IC3.16 69.88,39.7 72.83,36.95 72.83,31.53 v70.78,29.08
  Bottom 0.305: v70.78,29.08 70.8,16.07 67.84,13.38 64.21,13.38 JP9.P14
N$39  (via drill 0.7)
  Top 0.305: IC3.17 70.18,40.34 73.54,37.23 73.54,30.55 v72.83,29.4
  Bottom 0.305: v72.83,29.4 71.68,27.28 71.68,15.29 67.21,10.83 64.21,10.83 JP9.P16
N$40  (via drill 0.7)
  Top 0.305: IC3.18 70.49,40.99 74.19,37.55 74.19,29.27 v73.71,27.78
  Bottom 0.305: JP9.P15 65.47,9.55 67.53,9.55 73.07,14.96 73.07,25.87 v73.71,27.78
N$41
  Top 0.406: IC4.1 83.56,42.3
  Top 0.61: 83.56,42.3 R5.1
N$42
  Top 0.305: IC2.3 33.99,40.99 30.02,37.29 30.02,25.82 36.95,19.75 39.01,19.75 JP5.P8
N$43  (via drill 0.7)
  Top 0.305: IC4.13 93.48,37.74 95.02,36.24 95.02,34.01 v93.33,32.49
  Bottom 0.305: v93.33,32.49 92.17,31.24 92.17,19.14 91.41,18.47 89.02,18.47 JP12.P10
N$44
  Top 0.305: IC3.5 59.12,39.7 58.92,39.5 | 58.92,39.5 | 58.92,39.5 56.31,37.02 56.31,27.48 60.95,23.47 62.2,23.47 62.22,23.48 64.2,23.48 JP9.P5
N$45
  Top 0.305: IC1.6 9.94,39.05 7.96,37.08 7.96,27.66 11.51,24.76 U$6.P4 13.29,24.77
N$46
  Top 0.305: IC1.5 9.72,39.69 7.33,37.29 7.33,26.12 10.54,23.55 15.05,23.55 16.18,22.41 U$6.P5
N$47
  Top 0.305: IC1.7 10.16,38.39 8.59,36.82 8.59,32.87 13.64,28.45 U$6.P2
N$48
  Top 0.305: IC1.8 10.36,37.75 9.19,36.58 9.19,33.39 12.46,30.76 15.01,30.76 16.18,29.58 U$6.P1
N$49  (via drill 0.7)
  Top 0.305: IC4.14 93.79,38.4 95.72,36.53 95.72,33.03 v93.96,30.9
  Bottom 0.305: JP12.P12 89.01,15.93 91.41,15.93 92.98,17.22 92.98,29.33 93.03,29.96 v93.96,30.9
N$50  (via drill 0.7)
  Top 0.305: IC4.15 94.09,39.05 96.36,36.8 96.36,32.02 v95.63,31.02
  Bottom 0.305: JP12.P11 90.28,14.65 91.73,14.65 93.92,16.34 93.87,28.74 v95.63,31.02
N$51  (via drill 0.7)
  Top 0.305: IC4.16 94.4,39.7 97.15,36.95 97.15,30.58 v95.85,29.11
  Bottom 0.305: JP12.P14 89,13.38 91.73,13.38 94.87,15.78 94.85,27.15 94.85,27.47 v95.85,29.11
N$52  (via drill 0.7)
  Top 0.305: IC4.17 94.71,40.34 98.1,36.95 98.1,29.94 v97.56,29.3
  Bottom 0.305: JP12.P16 88.99,10.83 91.73,10.83 96.15,15.17 96.17,26.7 96.2,26.78 v97.56,29.3
N$53  (via drill 0.7)
  Top 0.305: IC4.18 95.01,40.99 99.06,36.95 99.06,28.67 v98.03,27.49
  Bottom 0.305: v98.03,27.49 97.28,26.63 97.25,14.63 92.05,9.55 90.26,9.55 JP12.P15
N$54
  Top 0.406: JP_PROG.1
  Top 0.61: U$5.GND2 48.33,67.42 52.57,63.19 JP_PROG.1
N$55
  Top 0.406: 54.51,65.74 JP_PROG.2
  Top 0.61: U$5.PROG 48.17,69.96 52.39,65.74 54.51,65.74
N$56
  Top 0.406: 19.04,42.98 19.04,42.3 IC1.20
  Top 0.813: C1.1 18.65,46.33 19.03,45.94 19.04,42.98
N$57
  Top 0.406: 67.98,42.3 IC3.20 68.41,42.3 68.4,42.97
  Top 0.813: 68.4,42.97 68.41,46.57 68.16,46.82 66.23,46.82 C7.1
N$58
  Top 0.406: IC2.20 43.89,42.3 43.88,42.69 43.89,43.02 | 41.93,46.34 C2.1
  Top 0.813: 41.93,46.34 43.73,46.34 43.9,46.18 43.89,43.02
N$59  (via drill 0.6)
  Top 0.305: IC4.11 | IC4.11 92.97,36.45 93.41,36 v93.41,35.24
  Bottom 0.61: v93.41,35.24 95.93,35.24 95.93,40.01 JP_SIGOUT.1
N$60  (via drill 0.6)
  Top 0.305: IC4.12 93.25,37.09 94.43,35.93 94.44,34.64 93.53,33.97 v92.14,33.97
  Bottom 0.61: v92.14,33.97 97.2,33.97 97.2,37.47 JP_SIGOUT.2
N$61
  Top 0.305: IC3.3 58.51,40.99 54.85,37.67 54.85,24.3 59.88,19.75 62.84,19.75 JP9.P8
N$62
  Top 0.305: IC4.3 83.04,40.99 79.63,37.59 79.63,25.48 85.36,19.75 87.63,19.75 JP12.P8
N$71
  Top 0.305: IC4.4 83.34,40.34 80.27,37.27 80.27,27.39 85.04,22.3 87.62,22.3 JP12.P6
N$79
  Top 0.305: IC4.5 83.65,39.7 80.9,36.95 80.9,28.6 86.02,23.48 87.11,23.48 89.04,23.48 JP12.P5
N$80
  Top 0.305: IC4.8 84.57,37.74 82.94,36.18 82.96,34.2 87.91,29.62 89.18,29.62 90.23,28.58 JP12.P1
SCKI  (via drill 0.6)
  Top 0.305: IC1.10 11.11,36.45 10.95,36.28 v10.95,35.54 v10.94,35.53
  Bottom 0.813: v10.94,35.53 8.75,35.53 5.1,39.5 5.1,58.92 10.19,63.07 23.89,63.07 32.17,71.35 32.17,72.3 | 32.17,72.3 32.17,77.77 JP_SIGIN.2 | U$5.13 46.32,73.08 45.55,72.3 32.17,72.3
SCKO1  (via drill 0.6)
  Top 0.305: IC1.11 18.49,36.44 18.72,36.21 v18.72,35.56 | IC2.10 37.18,36.45 35.95,36.45 35.57,36.02 35.57,35.88 v35.57,35.56
  Bottom 0.305: v18.72,35.56 21.23,35.24
  Bottom 0.813: v18.72,35.56 v35.57,35.56
SCKO2  (via drill 0.6)
  Top 0.305: v60.36,35.56 60.37,36.2 60.61,36.45 IC3.10 | IC2.11 44.14,36.45 44.27,36.31 v44.27,35.63 v44.28,35.63
  Bottom 0.406: 47.14,35.62
  Bottom 0.813: v44.28,35.63 47.14,35.62 v60.36,35.56
SCKO3  (via drill 0.6)
  Top 0.305: IC3.11 67.35,36.45 68.4,36.45 68.62,36.23 v68.62,35.24 | v84.5,35.21 84.49,35.89 84.49,35.91 85.02,36.44 IC4.10
  Bottom 0.813: v68.62,35.24 v84.5,35.21
SDTI  (via drill 0.6)
  Top 0.305: v11.26,33.97 10.23,33.97 9.83,34.37 9.83,36.27 10.66,37.09 IC1.9
  Top 0.406: 43.76,59.82 U$5.11
  Top 0.813: v21.98,65.93 40.68,65.93 43.76,62.85 43.76,59.82
  Bottom 0.813: v11.26,33.97 8.07,33.97 3.19,38.86 3.19,61.47 9.24,65.93 v21.98,65.93 25.16,69.12 25.8,69.75 27.71,69.75 29.94,71.98 29.94,77.45 JP_SIGIN.1
SDTO1  (via drill 0.6, 0.6 pad 1.02)
  Top 0.305: IC1.12 18.95,37.1 20,35.97 20,34.78 19.14,33.97 v16.82,33.97 | v37.16,33.97 35.33,33.97 34.3,34.63 34.3,35.8 35.74,37.09 IC2.9
  Bottom 0.305: 16.88,34.03 v16.82,33.97
  Bottom 0.813: v16.82,33.97 v37.16,33.97
SDTO2  (via drill 0.6)
  Top 0.305: v61,33.97 59.99,33.97 59.11,34.78 59.11,35.95 60.45,37.1 IC3.9 | IC2.12 44.45,37.09 45.55,35.99 45.55,34.85 44.66,33.96 v43.21,33.96 v43.2,33.97
  Bottom 0.406: 43,34.17 v43.2,33.97
  Bottom 0.813: v43.2,33.97 v61,33.97
SDTO3  (via drill 0.6)
  Top 0.305: v85.65,33.59 84.6,33.64 83.55,34.7 83.55,35.92 84.84,37.09 IC4.9 | IC3.12 67.3,37.11 68.7,37.1 69.75,36.18 69.75,34.86 69.17,34.13 v67.98,33.65
  Bottom 0.813: v67.98,33.65 v85.65,33.59
VCC  (via drill 0.6)
  Top 0.406: IC4.20 92.94,42.3 92.95,42.96 | v101.29,48.73 101.29,50.65 LED1.A | v91.1,43.64 92.92,43.64
  Top 0.813: 92.95,42.96 92.92,43.64 92.92,44.78 92.23,45.72 90.76,45.72 C9.1
  Bottom 0.406: v101.29,48.73 101.34,48.68 101.34,47.11 99.78,45.55 93.01,45.55 v91.1,43.64
(copper drawn outside any net)
  shapes: Top area x8

### Text on the board
tPlace: +5V | V+ | +5V | GND | +15V | DIN | CIN | PROG | GND | r | b | b | g | 3 | g | r | r | b | CO | b | g | 2 | g | r | DO | 1 | 2 | 3 | 4
tNames: 0 | 1